# Altium schematic sheet main.SchDoc
size A2
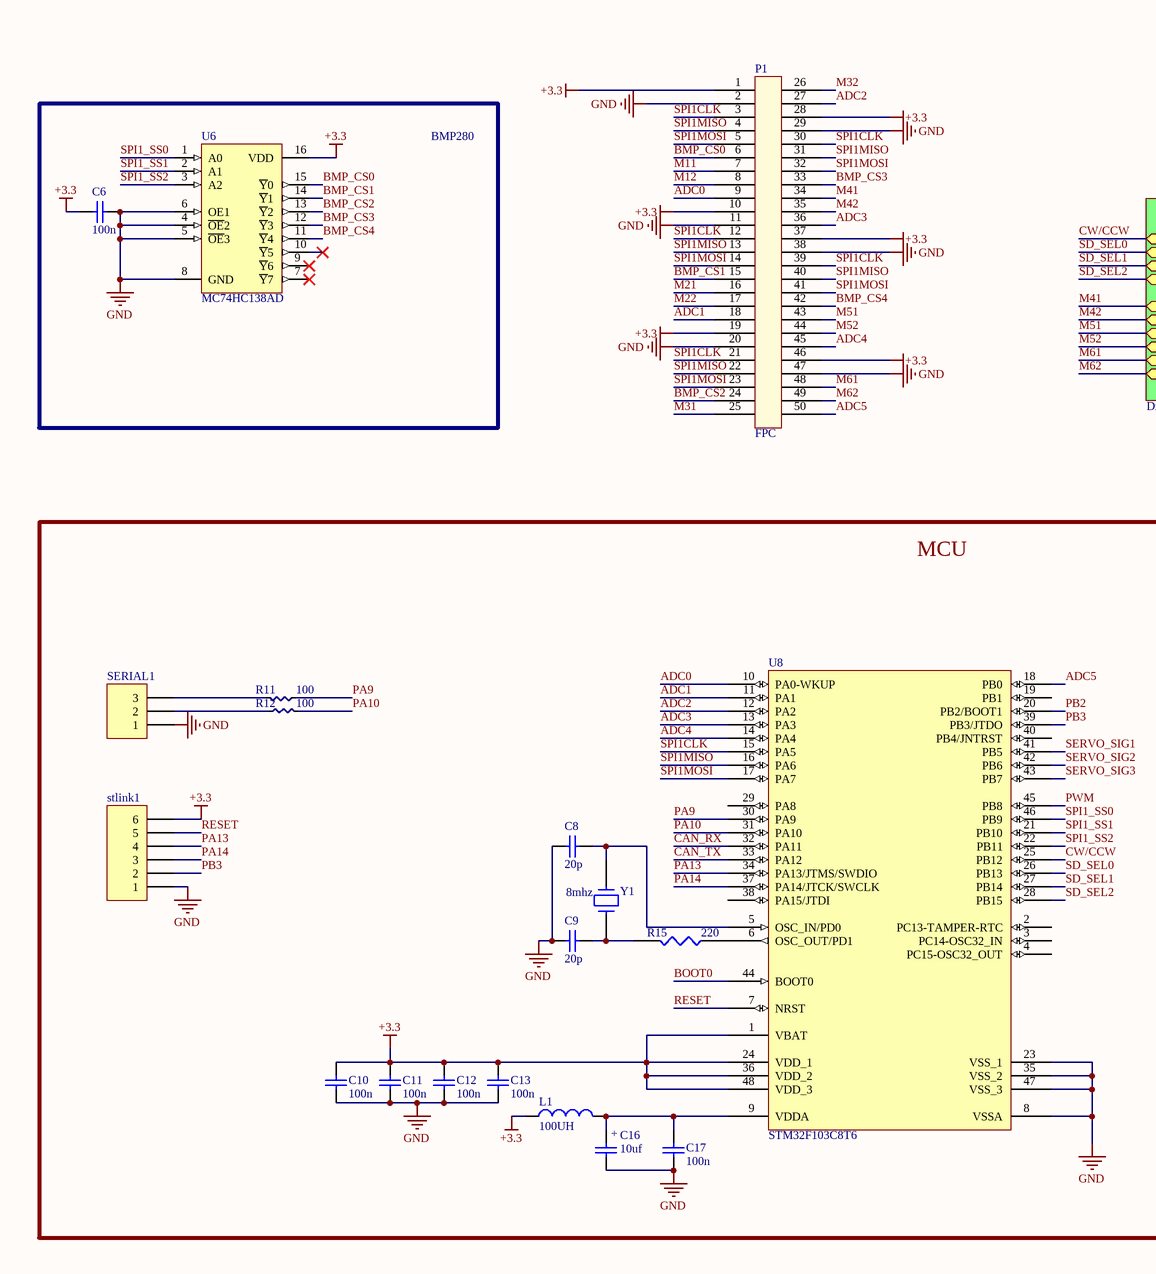
[diagram p0: main.SchDoc, left]
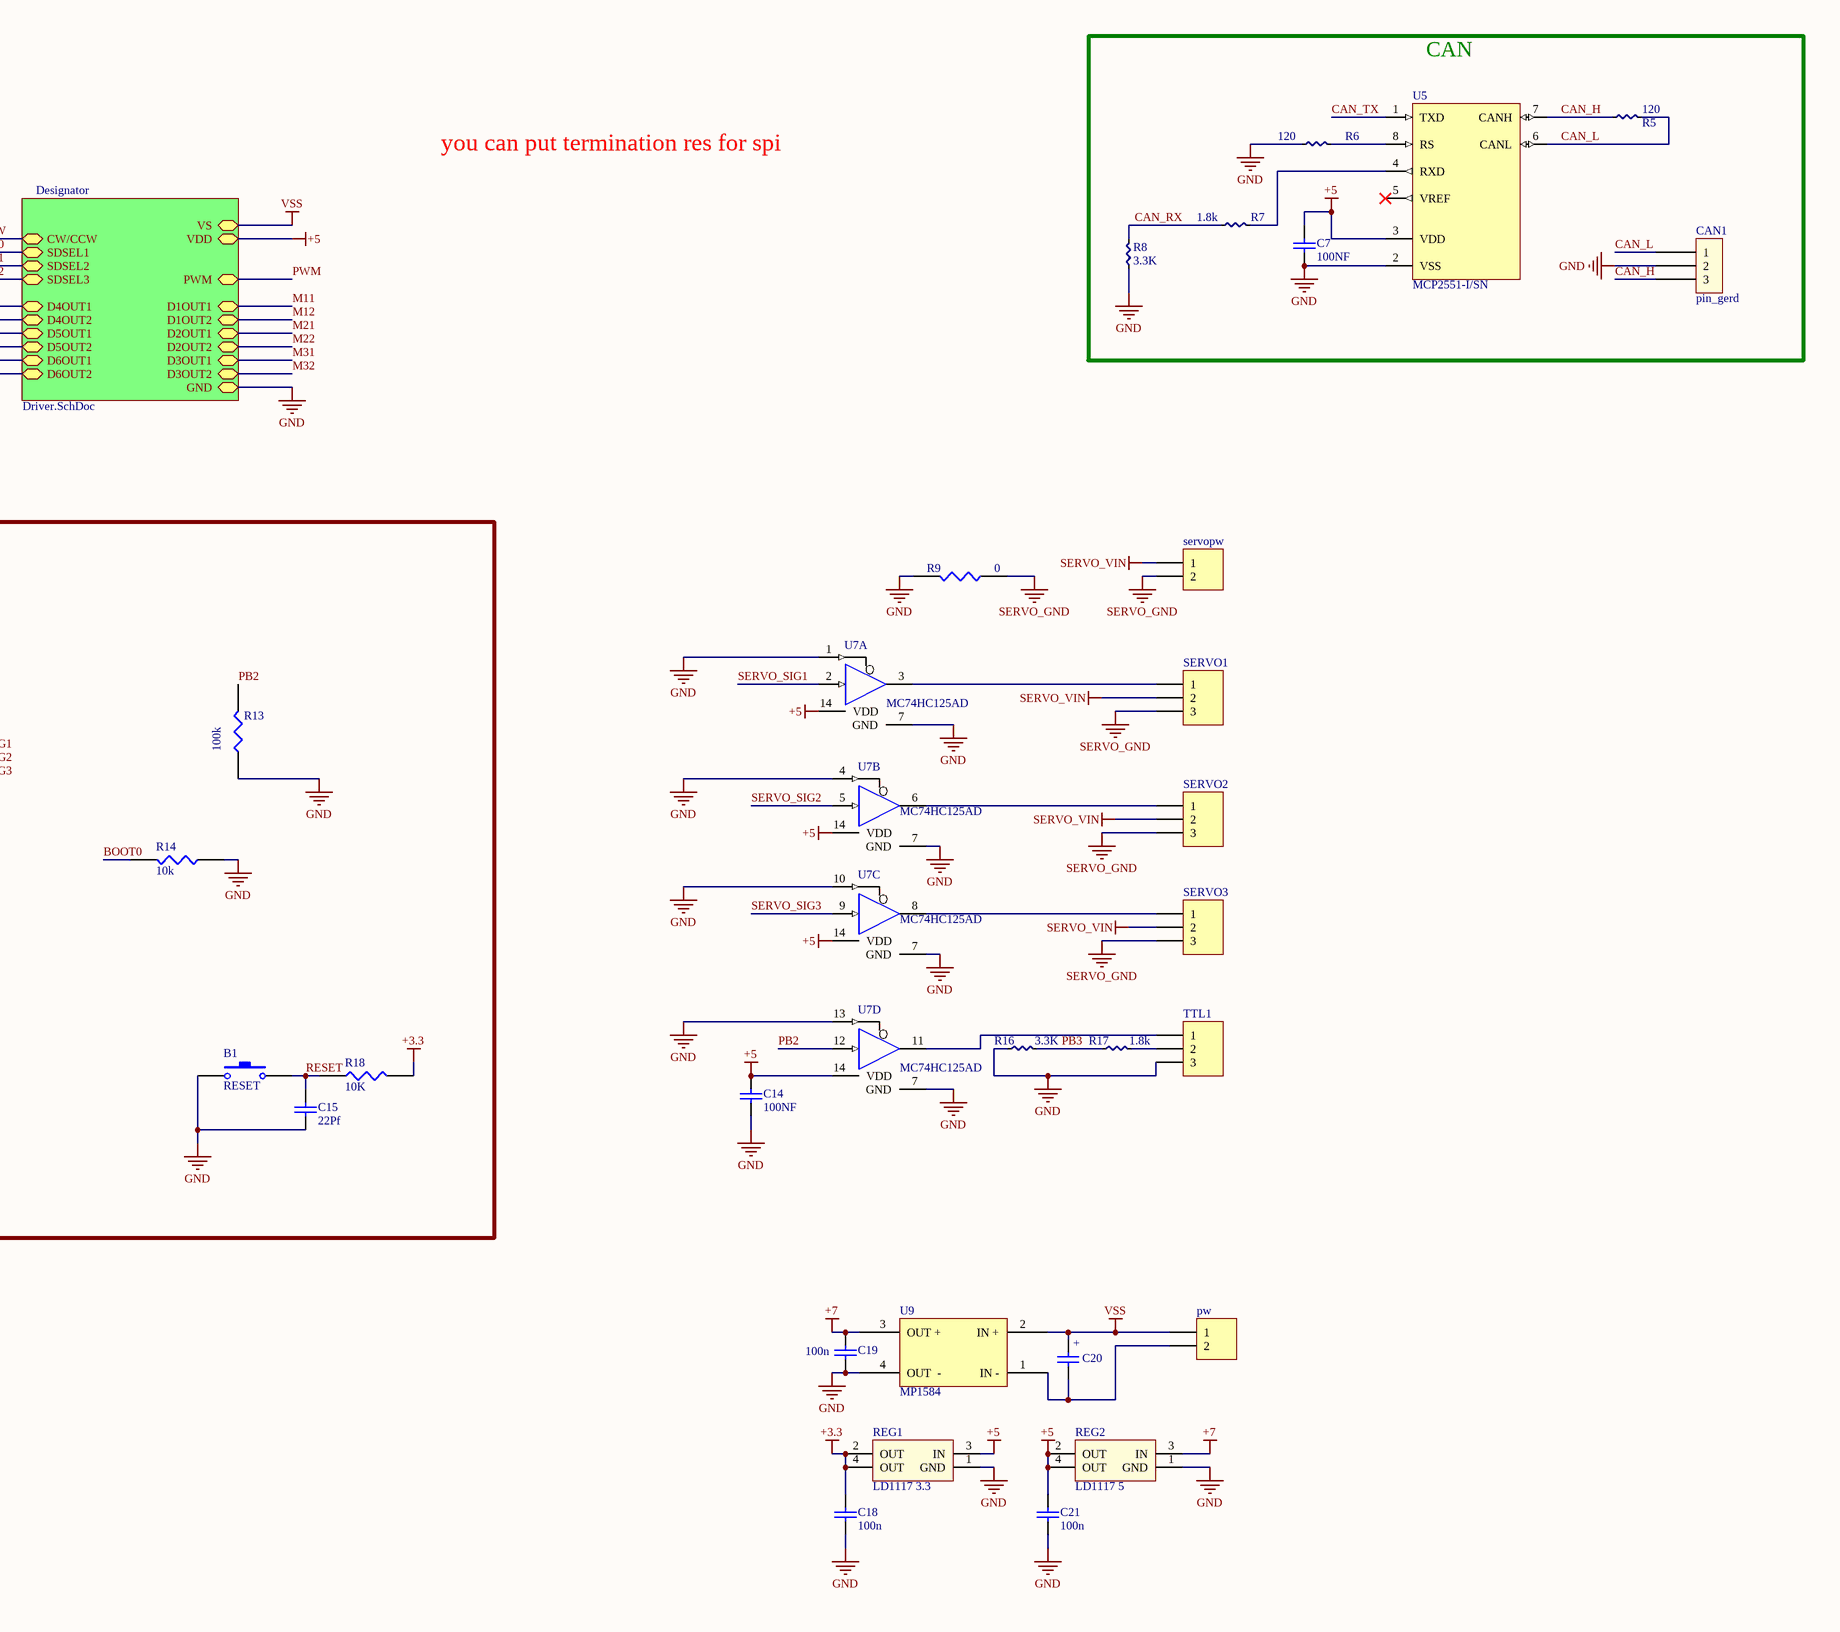
[diagram p1: main.SchDoc, right]

## Parts
B1  RESET  [SMD PUSH BUTTON]
C6  100n  [MY_CAP_SMD_0805]
C7  100NF  [MY_CAP_SMD_0805]
C8  20p  [MY_CAP_SMD_0805]
C9  20p  [MY_CAP_SMD_0805]
C10  100n  [MY_CAP_SMD_0805]
C11  100n  [MY_CAP_SMD_0805]
C12  100n  [MY_CAP_SMD_0805]
C13  100n  [MY_CAP_SMD_0805]
C14  100NF  [MY_CAP_SMD_0805]
C15  22Pf  [MY_CAP_SMD_0805]
C16  10uf  [MY_cap_smd10uf]
C17  100n  [MY_CAP_SMD_0805]
C18  100n  [MY_CAP_SMD_0805]
C19  100n  [MY_CAP_SMD_0805]
C20  Cap  [MY_CAP_SMD-C]  (value not drawn)
C21  100n  [MY_CAP_SMD_0805]
CAN1  pin_gerd  [MY_PINGERD3]
L1  100UH  [MY_SMD_INDUCTOR]
P1  FPC  [FPC-50-POS-0.5-MM]
pw  Header 2  [My_1X02]  (value not drawn)
R5  120  [MY_RES_SMD_0805]
R6  120  [MY_RES_SMD_0805]
R7  1.8k  [MY_RES_SMD_0805]
R8  3.3K  [MY_RES_SMD_0805]
R9  0  [MY_RES_SMD_0805]
R11  100  [MY_RES_SMD_0805]
R12  100  [MY_RES_SMD_0805]
R13  100k  [MY_RES_SMD_0805]
R14  10k  [MY_RES_SMD_0805]
R15  220  [MY_RES_SMD_0805]
R16  3.3K  [MY_RES_SMD_0805]
R17  1.8k  [MY_RES_SMD_0805]
R18  10K  [MY_RES_SMD_0805]
REG1  LD1117 3.3  [MY_LD1117-3.3]
REG2  LD1117 5  [MY_LD1117-3.3]
SERIAL1  Header 3  [My_1X03]  (value not drawn)
SERVO1  Header 3  [My_1X03]  (value not drawn)
SERVO2  Header 3  [My_1X03]  (value not drawn)
SERVO3  Header 3  [My_1X03]  (value not drawn)
servopw  Header 2  [My_1X02]  (value not drawn)
stlink1  Header 6  [My_1X06]  (value not drawn)
TTL1  Header 3  [My_1X03]  (value not drawn)
U5  MCP2551-I/SN  [SOIC-SN8_N]
U6  MC74HC138AD  [751B-03_N]
U7  MC74HC125AD  [751A-02_N]  (parts A,B,C,D of 4)
U8  STM32F103C8T6  [LQFP48_N]
U9  MP1584  [mp1584]
Y1  8mhz  [My_Crystal - SMD]

## Blocks framed on the sheet
CAN: C7 CAN1 R5-R8 U5
BMP280: C6 U6
MCU: B1 C8-C13 C15-C17 L1 R11-R15 R18 SERIAL1 stlink1 U8 Y1

## Sub-sheets
Designator = Driver.SchDoc: CW/CCW, GND, PWM, D1OUT1, D1OUT2, VDD, VS, SDSEL1, SDSEL2, SDSEL3, D2OUT1, D2OUT2, D3OUT1, D3OUT2, D4OUT1, D4OUT2, D5OUT1, D5OUT2, D6OUT1, D6OUT2

## Nets
+3.3: C6.2 C10.2 C11.2 C12.2 C13.2 C18.2 L1.1 P1.1 P1.10 P1.19 P1.28 P1.37 P1.46 R18.2 REG1.2(OUT) REG1.4(OUT) stlink1.6 U6.16(VDD) U8.1(VBAT) U8.24(VDD_1) U8.36(VDD_2) U8.48(VDD_3)
+5: C7.2 C14.2 C21.2 REG1.3(IN) REG2.2(OUT) REG2.4(OUT) U5.3(VDD) U7.14(VDD) ; sheet Designator/VDD
+7: C19.2 REG2.3(IN) U9.3(OUT_+)
GND: B1.1 C6.1 C7.1 C8.2 C9.1 C10.1 C11.1 C12.1 C13.1 C14.1 C15.1 C16.- C17.1 C18.1 C19.1 C21.1 CAN1.2 P1.2 P1.11 P1.20 P1.29 P1.38 P1.47 R6.1 R8.1 R9.2 R13.1 R14.1 R16.1 REG1.1(GND) REG2.1(GND) SERIAL1.1 stlink1.1 TTL1.3 U5.2(VSS) U6.4(~{OE}2) U6.5(~{OE}3) U6.6(OE1) U6.8(GND) U7.1(~{OE}) U7.4(~{OE}) U7.7(GND) U7.10(~{OE}) U7.13(~{OE}) U8.8(VSSA) U8.23(VSS_1) U8.35(VSS_2) U8.47(VSS_3) U9.4(OUT__-) ; sheet Designator/GND
SERVO_GND: R9.1 SERVO1.3 SERVO2.3 SERVO3.3 servopw.2
SERVO_VIN: SERVO1.2 SERVO2.2 SERVO3.2 servopw.1
VSS: C20.+ pw.1 U9.2(IN_+) ; sheet Designator/VS
ADC0: P1.9 U8.10(PA0-WKUP)
ADC1: P1.18 U8.11(PA1)
ADC2: P1.27 U8.12(PA2)
ADC3: P1.36 U8.13(PA3)
ADC4: P1.45 U8.14(PA4)
ADC5: P1.50 U8.18(PB0)
BMP_CS0: P1.6 U6.15(~{Y}0)
BMP_CS1: P1.15 U6.14(~{Y}1)
BMP_CS2: P1.24 U6.13(~{Y}2)
BMP_CS3: P1.33 U6.12(~{Y}3)
BMP_CS4: P1.42 U6.11(~{Y}4)
BOOT0: R14.2 U8.44(BOOT0)
CAN_H: CAN1.3 R5.1 U5.7(CANH)
CAN_L: CAN1.1 R5.2 U5.6(CANL)
CAN_RX: R7.1 R8.2 U8.32(PA11)
CAN_TX: U5.1(TXD) U8.33(PA12)
CW/CCW: U8.25(PB12) ; sheet Designator/CW/CCW
M11: P1.7 ; sheet Designator/D1OUT1
M12: P1.8 ; sheet Designator/D1OUT2
M21: P1.16 ; sheet Designator/D2OUT1
M22: P1.17 ; sheet Designator/D2OUT2
M31: P1.25 ; sheet Designator/D3OUT1
M32: P1.26 ; sheet Designator/D3OUT2
M41: P1.34 ; sheet Designator/D4OUT1
M42: P1.35 ; sheet Designator/D4OUT2
M51: P1.43 ; sheet Designator/D5OUT1
M52: P1.44 ; sheet Designator/D5OUT2
M61: P1.48 ; sheet Designator/D6OUT1
M62: P1.49 ; sheet Designator/D6OUT2
PA9: R11.1 U8.30(PA9)
PA10: R12.2 U8.31(PA10)
PA13: stlink1.4 U8.34(PA13/JTMS/SWDIO)
PA14: stlink1.3 U8.37(PA14/JTCK/SWCLK)
PB2: R13.2 U7.12(A) U8.20(PB2/BOOT1)
PB3: R16.2 R17.1 stlink1.2 U8.39(PB3/JTDO)
PWM: U8.45(PB8) ; sheet Designator/PWM
RESET: B1.2 C15.2 R18.1 stlink1.5 U8.7(NRST)
SD_SEL0: U8.26(PB13) ; sheet Designator/SDSEL1
SD_SEL1: U8.27(PB14) ; sheet Designator/SDSEL2
SD_SEL2: U8.28(PB15) ; sheet Designator/SDSEL3
SERVO_SIG1: U7.2(A) U8.41(PB5)
SERVO_SIG2: U7.5(A) U8.42(PB6)
SERVO_SIG3: U7.9(A) U8.43(PB7)
SPI1_SS0: U6.1(A0) U8.46(PB9)
SPI1_SS1: U6.2(A1) U8.21(PB10)
SPI1_SS2: U6.3(A2) U8.22(PB11)
SPI1CLK: P1.3 P1.12 P1.21 P1.30 P1.39 U8.15(PA5)
SPI1MISO: P1.4 P1.13 P1.22 P1.31 P1.40 U8.16(PA6)
SPI1MOSI: P1.5 P1.14 P1.23 P1.32 P1.41 U8.17(PA7)
NetC8_1: C8.1 U8.5(OSC_IN/PD0) Y1.2
NetC9_2: C9.2 R15.2 Y1.1
NetC16_+: C16.+ C17.2 L1.2 U8.9(VDDA)
NetC20_-: C20.- pw.2 U9.1(IN_-)
NetR6_2: R6.2 U5.8(RS)
NetR7_2: R7.2 U5.4(RXD)
NetR11_2: R11.2 SERIAL1.3
NetR12_1: R12.1 SERIAL1.2
NetR15_1: R15.1 U8.6(OSC_OUT/PD1)
NetR17_2: R17.2 TTL1.2
NetSERVO1_1: SERVO1.1 U7.3(Y)
NetSERVO2_1: SERVO2.1 U7.6(Y)
NetSERVO3_1: SERVO3.1 U7.8(Y)
NetTTL1_1: TTL1.1 U7.11(Y)

Not connected (* = marked no-connect by the designer): U5 5(VREF)*; U6 7(~{Y}7)* 9(~{Y}6)* 10(~{Y}5)*; U8 2(PC13-TAMPER-RTC) 3(PC14-OSC32_IN) 4(PC15-OSC32_OUT) 19(PB1) 29(PA8) 38(PA15/JTDI) 40(PB4/JNTRST)

## Notes on the sheet
- you can put termination res for spi

## Library data of the parts
B1 = SMD_PUSH_BUTTON
C6 C8-C13 C15 C17-C19 C21 = CAP SMD
C7 C14 = CAP SMD_0805: 2.0 mm × 1.25 mm
C16 = cap_smd_10u
C20 = CAP_TANTAL_C: 6X3.2MM; Value: 3300u
CAN1 = pin_gerd: 3pin
L1 = INDUCTOR SMD
P1 = FPC-50-POS-0.5-MM
pw servopw = Header 2: Header, 2-Pin; LatestRevisionDate: 17-Jul-2002; LatestRevisionNote: Re-released for DXP Platform.; Publisher: Altium Limited
R5-R8 R11 R12 R16 R17 = RES SMD 0805
R9 R13-R15 R18 = RES SMD
REG2 = LD1117 3.3
SERIAL1 SERVO1-SERVO3 TTL1 = Header 3: Header, 3-Pin; LatestRevisionDate: 17-Jul-2002; LatestRevisionNote: Re-released for DXP Platform.; Publisher: Altium Limited
  SERVO1: LINK: https://www.digikey.ca/en/products/detail/molex/0099990987/2405394
stlink1 = Header 6: Header, 6-Pin; LatestRevisionDate: 17-Jul-2002; LatestRevisionNote: Re-released for DXP Platform.; Publisher: Altium Limited
U5 = MCP2551-I/SN: High-Speed CAN Transceiver, 8-Pin SOIC, Industrial Temperature; Published: 29-Jan-2009; DatasheetVersion: revE, Jan-2007; PackageVersion: revAW, Oct-2008; PackageReference: SOIC-SN8; Publisher: Altium Limited; PackageDescription: 8-Lead Plastic Small Outline (SN) - Narrow, 3.90mm Body [SOIC]; Code_JEDEC: MS-012; Code_IPC: SOIC127P600-8; ComponentLink1Description: Manufacturer Link; ComponentLink1URL: http://www.microchip.com; ComponentLink2Description: Datasheet; ComponentLink2URL: http://ww1.microchip.com/downloads/en/DeviceDoc/21667E.pdf; ComponentLink3Description: Packaging Specification; ComponentLink3URL: http://ww1.microchip.com/downloads/en/PackagingSpec/00049AW.pdf
U6 = MC74HC138AD: 1-of-8 Decoder/Demultiplexer; Published: 17-Jul-2002; LatestRevisionDate: 13-Apr-2006; LatestRevisionNote: IPC-7351 Footprint Added.; DatasheetVersion: 1989; PackageVersion: 1991; PackageReference: 751B-03; Publisher: Altium Limited; PackageDescription: 16-Pin Small Outline Integrated Circuit 1.27 mm Pitch; Code_JEDEC: MS-012-AC; Code_IPC: SOIC127P600-16; ComponentLink1Description: Manufacturer Link; ComponentLink1URL: http://www.onsemi.com/site/products/parametrics/0,4446,419,00.html; ComponentLink2Description: Datasheet; ComponentLink2URL: http://www.onsemi.com/pub/Collateral/MC74HC138A-D.PDF
U7 = MC74HC125AD: Quad 3-State Non-Inverting Buffer; Published: 17-Jul-2002; LatestRevisionDate: 13-Apr-2006; LatestRevisionNote: IPC-7351 Footprint Added.; DatasheetVersion: 1989; PackageVersion: 1991; PackageReference: 751A-02; Publisher: Altium Limited; PackageDescription: 14-Pin Small Outline Integrated Circuit 1.27 mm Pitch; Code_IPC: SOIC127P600-14; ComponentLink1Description: Manufacturer Link; ComponentLink1URL: http://www.onsemi.com/site/products/parametrics/0,4446,178,00.html
U8 = STM32F103C8T6: STM32 ARM-based 32-bit MCU with 64 Kbytes Flash, 48-pin LQFP, Industrial Temperature; Published: 30-May-2008; DatasheetVersion: rev6, Mar-2008; PackageVersion: Mar-2008; PackageReference: LQFP48; Publisher: Altium Limited; PackageDescription: 48-Pin Low-Profile Quad Flat Pack, 7 x 7 mm Body, 0.5 mm Pitch (LQFP48); ComponentLink1Description: Manufacturer Link; ComponentLink1URL: www.st.com/stm32; ComponentLink2Description: Datasheet; ComponentLink2URL: http://www.st.com/stonline/products/literature/ds/13587.pdf; Link: https://www.digikey.ca/en/products/detail/stmicroelectronics/stm32f103c8t6/1646338
U9 = MP1584: SWITCHING REGULATOR MODULE; PART: MP1584EN-LF-Z; LINK: https://www.digikey.ca/en/products/detail/monolithic-power-systems-inc/MP1584EN-LF-Z/5291742; PACKAGE: 8-SOIC (0.154", 3.90mm Width) Exposed Pad
Y1 = CRYSTAL